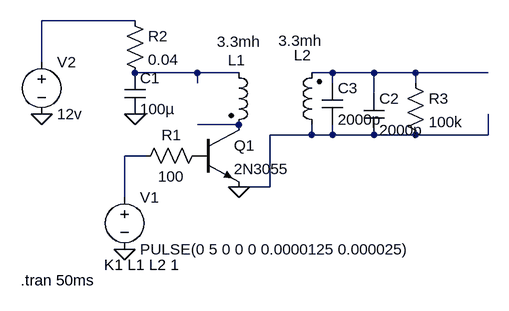
[diagram p0: schematic Draft2.asc]
Draft2.asc, the LTspice schematic file:
Version 4
SHEET 1 880 680
WIRE -288 -192 -432 -192
WIRE -432 -128 -432 -192
WIRE -192 -112 -288 -112
WIRE -128 -112 -192 -112
WIRE 16 -112 -16 -112
WIRE 80 -112 16 -112
WIRE 144 -112 80 -112
WIRE 256 -112 144 -112
WIRE -192 -96 -192 -112
WIRE 16 -96 16 -112
WIRE 144 -96 144 -112
WIRE 80 -80 80 -112
WIRE -128 -32 -192 -32
WIRE -16 -16 -16 -32
WIRE -16 -16 -80 -16
WIRE 16 -16 16 -32
WIRE 16 -16 -16 -16
WIRE 80 -16 16 -16
WIRE 144 -16 80 -16
WIRE 256 -16 256 -48
WIRE 256 -16 144 -16
WIRE -272 16 -304 16
WIRE -80 64 -80 -16
WIRE -80 64 -128 64
WIRE -304 80 -304 16
FLAG -304 160 0
FLAG -128 64 0
FLAG -288 -48 0
FLAG -432 -48 0
SYMBOL voltage -304 64 R0
WINDOW 123 0 0 Left 2
WINDOW 39 0 0 Left 2
SYMATTR InstName V1
SYMATTR Value PULSE(0 5 0 0 0 0.0000125 0.000025)
SYMBOL res -176 0 R90
WINDOW 0 0 56 VBottom 2
WINDOW 3 32 56 VTop 2
SYMATTR InstName R1
SYMATTR Value 100
SYMBOL npn -192 -32 R0
SYMATTR InstName Q1
SYMATTR Value 2N3055
SYMBOL ind2 -144 -128 R0
WINDOW 0 -1 -3 Left 2
WINDOW 3 -18 -32 Left 2
SYMATTR InstName L1
SYMATTR Value 3.3mh
SYMATTR Type ind
SYMATTR SpiceLine Rser=0.04
SYMBOL cap -304 -112 R0
SYMATTR InstName C1
SYMATTR Value 100µ
SYMBOL res -304 -208 R0
SYMATTR InstName R2
SYMATTR Value 0.04
SYMBOL voltage -432 -144 R0
WINDOW 123 0 0 Left 2
WINDOW 39 0 0 Left 2
SYMATTR InstName V2
SYMATTR Value 12v
SYMBOL cap 64 -80 R0
SYMATTR InstName C2
SYMATTR Value 2000p
SYMBOL res 128 -112 R0
SYMATTR InstName R3
SYMATTR Value 100k
SYMBOL cap 0 -96 R0
SYMATTR InstName C3
SYMATTR Value 2000p
SYMBOL ind2 0 -16 R180
WINDOW 0 16 123 Left 2
WINDOW 3 0 145 Left 2
SYMATTR InstName L2
SYMATTR Value 3.3mh
SYMATTR Type ind
SYMATTR SpiceLine Rser=0.04
TEXT -336 184 Left 2 !K1 L1 L2 1
TEXT -464 208 Left 2 !.tran 50ms

The netlist it stands for:
* Draft2.asc
V1 N005 0 PULSE(0 5 0 0 0 0.0000125 0.000025)
R1 P001 N005 100
Q1 N004 P001 0 0 2N3055
L1 N002 N004 3.3mh Rser=0.04
C1 N002 0 100µ
R2 N001 N002 0.04
V2 N001 0 12v
C2 N003 0 2000p
R3 N003 0 100k
C3 N003 0 2000p
L2 0 N003 3.3mh Rser=0.04
.model NPN NPN
.model PNP PNP
.lib standard.bjt
K1 L1 L2 1
.tran 50ms
.backanno
.end